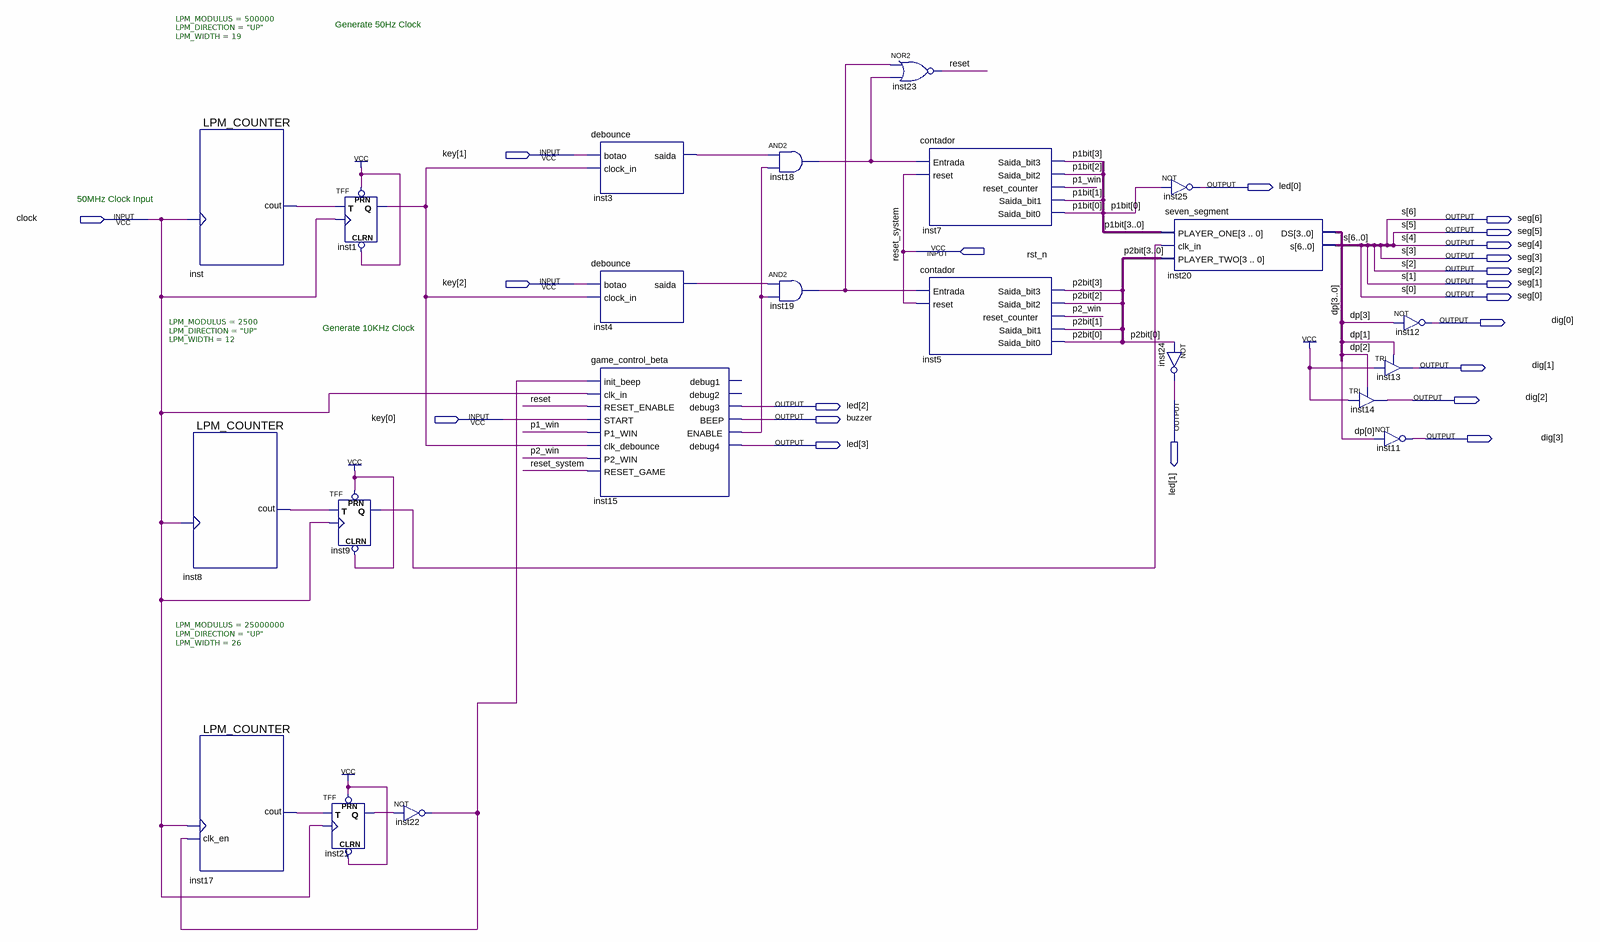
[diagram p0: schematic sheet]
// Quartus schematic top.bdf as structural Verilog: 22 symbols, 21 pins
module top (
  input  [2:0] key,
  input  clock,
  input  rst_n,
  output [3:0] led,
  output [6:0] seg,
  output [3:0] dig,
  output buzzer
);

  wire inst1_q, inst3_saida, inst4_saida, inst8_cout, inst9_q, inst15_enable, inst17_cout, inst18_out,
       inst19_out, inst21_q, inst22_out, inst_cout, p1_win, p2_win, reset;
  wire [3:0] dp, p1bit, p2bit;

  LPM_COUNTER #(.LPM_MODULUS(500000), .LPM_DIRECTION("UP"), .LPM_WIDTH(19)) inst (.clock(clock), .cout(inst_cout));
  LPM_COUNTER #(.LPM_MODULUS(2500), .LPM_DIRECTION("UP"), .LPM_WIDTH(12)) inst8 (.clock(clock), .cout(inst8_cout));
  LPM_COUNTER #(.LPM_MODULUS(25000000), .LPM_DIRECTION("UP"), .LPM_WIDTH(26)) inst17 (
    .clk_en(inst22_out), .clock(clock), .cout(inst17_cout));
  TFF inst1 (.PRN(1'b1), .CLRN(1'b1), .T(inst_cout), .CLK(clock), .Q(inst1_q));
  TFF inst9 (.PRN(1'b1), .CLRN(1'b1), .T(inst8_cout), .CLK(clock), .Q(inst9_q));
  TFF inst21 (.PRN(1'b1), .CLRN(1'b1), .T(inst17_cout), .CLK(clock), .Q(inst21_q));
  not inst22 (inst22_out, inst21_q);
  debounce inst3 (.botao(key[1]), .clock_in(inst1_q), .saida(inst3_saida));
  debounce inst4 (.botao(key[2]), .clock_in(inst1_q), .saida(inst4_saida));
  game_control_beta inst15 (
    .init_beep(inst22_out), .clk_in(clock), .RESET_ENABLE(reset), .START(key[0]), .P1_WIN(p1_win),
    .clk_debounce(inst1_q), .P2_WIN(p2_win), .RESET_GAME(rst_n), .debug3(led[2]), .BEEP(buzzer),
    .ENABLE(inst15_enable), .debug4(led[3]));  // open: debug1, debug2
  and inst18 (inst18_out, inst3_saida, inst15_enable);
  and inst19 (inst19_out, inst4_saida, inst15_enable);
  nor inst23 (reset, inst19_out, inst18_out);
  contador inst7 (
    .Entrada(inst18_out), .reset(rst_n), .Saida_bit3(p1bit[3]), .Saida_bit2(p1bit[2]),
    .reset_counter(p1_win), .Saida_bit1(p1bit[1]), .Saida_bit0(p1bit[0]));
  contador inst5 (
    .Entrada(inst19_out), .reset(rst_n), .Saida_bit3(p2bit[3]), .Saida_bit2(p2bit[2]),
    .reset_counter(p2_win), .Saida_bit1(p2bit[1]), .Saida_bit0(p2bit[0]));
  not inst25 (led[0], p1bit[0]);
  seven_segment inst20 (.PLAYER_ONE(p1bit), .clk_in(inst9_q), .PLAYER_TWO(p2bit), .DS(dp), .s(seg));
  not inst24 (led[1], p2bit[0]);
  TRI inst13 (.IN(1'b1), .OE(dp[1]), .OUT(dig[1]));
  TRI inst14 (.IN(1'b1), .OE(dp[2]), .OUT(dig[2]));
  not inst11 (dig[3], dp[0]);
  not inst12 (dig[0], dp[3]);

  // Other names for the same wires on the sheet: reset_system = rst_n; s[6:0] = seg

  // Notes on the sheet:
  //   Generate 50Hz Clock
  //   50MHz Clock Input
  //   Generate 10KHz Clock
endmodule
